# Altium schematic sheet hiiri627v07.SchDoc: hiiri627v07
size 210 x 152 mm; Date: 31.05.2020 0:45:57; SheetNumber: 1; GateName_1: G$1; SymbolName_1: A5L-LOC; LibraryName: frames; DeviceSetName: DINA5_L; A: A; B: B; C: C; 1: 1; 2: 2; 3: 3; 4: 4; Sheet: Sheet:
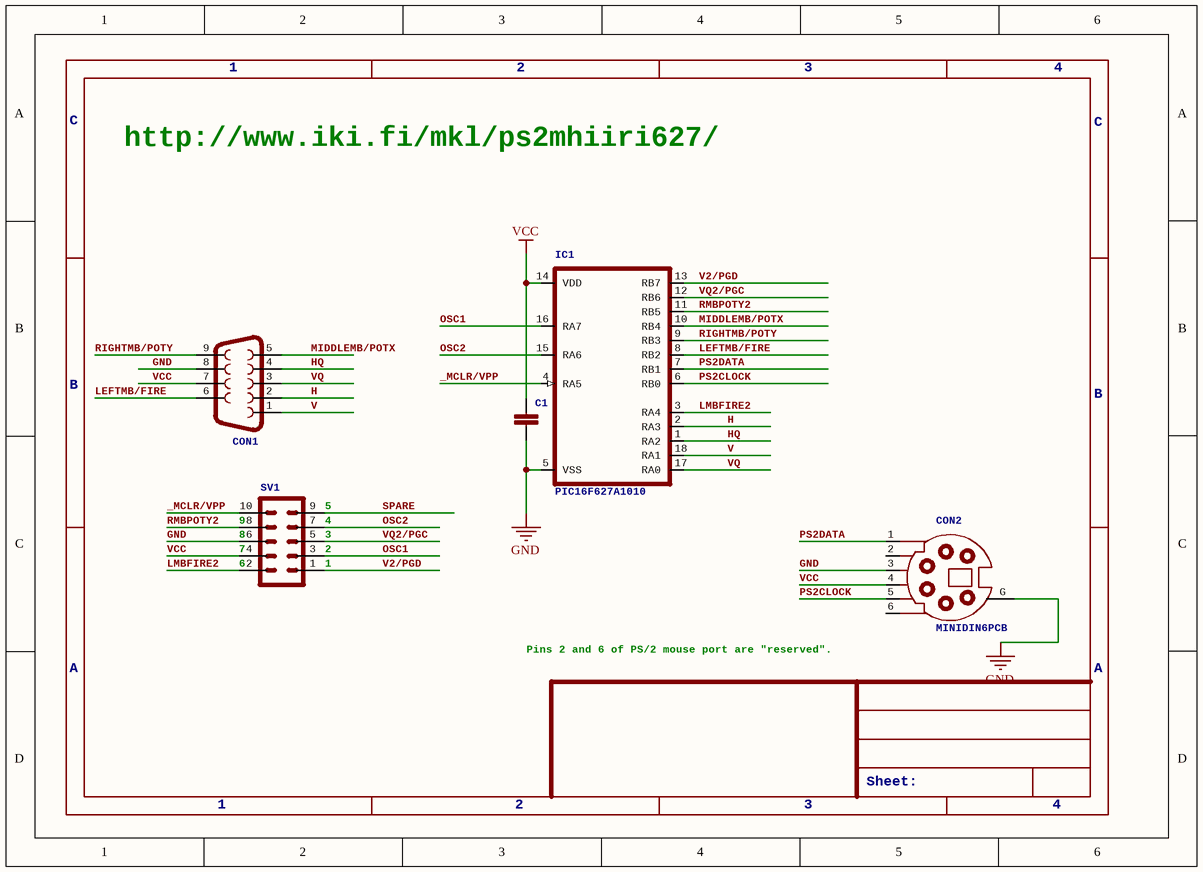
[diagram p0: hiiri627v07.SchDoc]

## Parts
C1  C-EUC0805K  [C0805K]  (value not drawn)
CON1  F09D  [F09D]  (value not drawn)
CON2  MINIDIN6PCB  [MINIDIN6PCB]
IC1  PIC16F627A1010  [SO18-10101020]
SV1  ML10  [ML10]  (value not drawn)

## Nets
GND: C1.2 CON1.8 CON2.3 CON2.G IC1.5(VSS) SV1.6
VCC: C1.1 CON1.7 CON2.4 IC1.14(VDD) SV1.4
_MCLR/VPP: IC1.4(RA5) SV1.10
H: CON1.2 IC1.2(RA3)
HQ: CON1.4 IC1.1(RA2)
LEFTMB/FIRE: CON1.6 IC1.8(RB2)
LMBFIRE2: IC1.3(RA4) SV1.2
MIDDLEMB/POTX: CON1.5 IC1.10(RB4)
OSC1: IC1.16(RA7) SV1.3
OSC2: IC1.15(RA6) SV1.7
PS2CLOCK: CON2.5 IC1.6(RB0)
PS2DATA: CON2.1 IC1.7(RB1)
RIGHTMB/POTY: CON1.9 IC1.9(RB3)
RMBPOTY2: IC1.11(RB5) SV1.8
SPARE: SV1.9
V: CON1.1 IC1.18(RA1)
V2/PGD: IC1.13(RB7) SV1.1
VQ: CON1.3 IC1.17(RA0)
VQ2/PGC: IC1.12(RB6) SV1.5

Not connected (* = marked no-connect by the designer): CON2 2 6

## Notes on the sheet
- 1
- 2
- 3
- 4
- C
- http://www.iki.fi/mkl/ps2mhiiri627/
- B
- (near SV1) 9
- (near SV1) 8
- (near SV1) 3
- (near SV1) 4
- (near SV1) 5
- (near SV1) 6
- (near SV1) 7
- (near SV1) 1
- (near SV1) 2
- A
- Pins 2 and 6 of PS/2 mouse port are "reserved".
- Sheet:

## Library data of the parts
C1 = C-EUC0805K: CAPACITOR, European symbol; GateName_1: G$1; SymbolName_1: C-EU; DeviceName: C0805K; LibraryName: rcl; DeviceSetName: C-EU
CON1 = F09D: SUB-D; GateName_1: G$1; SymbolName_1: F09; DeviceName: D; LibraryName: con-subd; DeviceSetName: F09
CON2 = MINIDIN6PCB: GateName_1: G$1; SymbolName_1: MINIDIN6PCB_SYM; LibraryName: 0mikacon; DeviceSetName: MINIDIN6PCB
IC1 = PIC16F627A1010: GateName_1: G$1; SymbolName_1: PIC16F627_SYM; DeviceName: 1010; LibraryName: 0mikalib; DeviceSetName: PIC16F627A
SV1 = ML10: HARTING; GateName_1: G$1; SymbolName_1: 10P; LibraryName: con-harting-ml; DeviceSetName: ML10